# EAGLE design sensor (EAGLE 5.11)
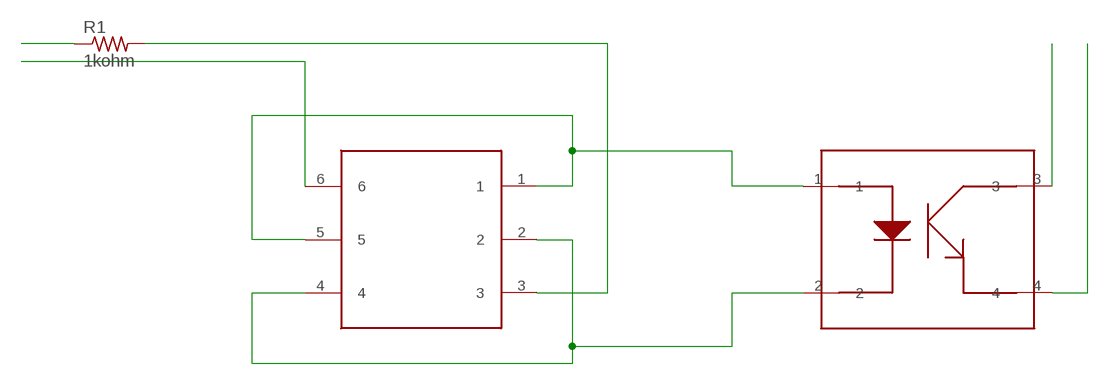
[diagram p0: schematic, sheet 1]

## Parts
R1  1kohm  R-US_M0805  [M0805]
U$1  MA125  [MA125]
U$2  TPR-105F  [TPR-105F]

## Nets
N$1: U$1.1 U$1.5 U$2.1
N$2: U$1.2 U$1.4 U$2.2
N$3: R1.2 U$1.3
N$4: U$1.6
N$5: R1.1
N$6: U$2.3
N$7: U$2.4

## Library data of the parts
R1 = rcl:R-US_: RESISTOR, American symbol
U$1 = myparts:MA125
U$2 = myparts:TPR-105F

## Board
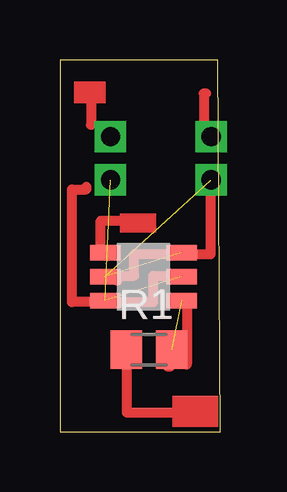
[diagram p1: board, top side]
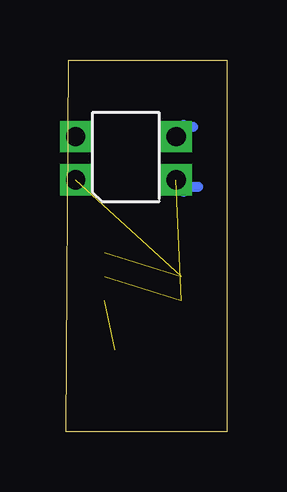
[diagram p2: board, bottom side, seen from below]

Size 6.7 x 15.5 mm. Coordinates in mm from the lower left corner, seen from the top.
Outline: 0,0 6.7,0 6.6,15.5 0,15.5 0,0
Copper layers (1*16): Top 0.035mm / dielectric 1.5mm / Bottom 0.035mm
Design rules "default *": minimum track width 10mil, minimum drill 24mil, track to track 8mil, track to pad 4mil, pad to pad 4mil, via to via 4mil, smd to smd 4mil, copper to edge 40mil, drill to drill 8mil, minimum pad ring 10mil, minimum via ring 8mil, stop-mask expansion 4mil, vias tented up to drill 0mil, thermal gap 10mil

### Footprints (pad centres in the part's own frame; a part is rotated, then mirrored left to right if it is on the bottom)
M0805 = smd 1.3 x 1.6: 1 -0.95,0; 2 0.95,0
MA125 = smd 1.27 x 0.635: 1 2,-0.6; 2 2,-1.6; 3 2,-2.6; 4 -1.2,-2.6; 5 -1.2,-1.6; 6 -1.2,-0.6
TPR-105F = drill 0.8 square: 1 2.7,1.5; 2 -1.5,1.5; 3 -1.5,-0.3; 4 2.7,-0.3

### Placement (x,y rotation side)
R1  3.72,3.41 0 top
U$1  3.09,8.06 0 top
U$2  3.61,12 180 bottom

### Tracks (layer width: path | path; a pad name or v marks a point on that pad's centre or on a via)
N$1  (2 unrouted)
N$2  (2 unrouted)
N$3  (1 unrouted)
N$8
  Top 0.406: 5.3,7.4 6.3,7.4 6.3,10.1
N$9
  Top 0.406: 2.4,6.3 2.4,6.5 3.1,6.5 3.1,7.4 4.8,7.4
N$10
  Top 0.406: 1.5,5.4 0.5,5.4 0.5,10.1 1.1,10.1 1.1,10.2
N$11
  Top 0.406: 4.6,2.7 4.5,2.7
N$12
  Top 0.406: 1.7,7.4 1.7,8.8 3.2,8.8 3.2,8.6
N$13
  Top 0.406: 2.4,5.4 3.9,5.4 3.9,6.5 4.9,6.5 4.9,6.4
N$14
  Top 0.406: 5.3,5.2 5.3,2.8
N$15
  Top 0.406: 6.1,0.6 6.1,0.5
N$16
  Top 0.406: 2.8,3.1 2.8,0.8 6.2,0.8 6.2,0.9
N$17
  Bottom 0.406: 1.4,12.7 1.8,12.7 1.8,12.8
N$18
  Bottom 0.406: 1.2,10.2 1.8,10.2 1.8,10
N$19
  Top 0.406: 1.3,14 1.3,12.8
N$20
  Top 0.406: 6.1,14.1 6,14.1 6,12.5
(copper drawn outside any net)
  shapes: Top area x3